# Altium schematic sheet Buck-Boost-5V.schdoc: TITRE
size Letter; ApprovedBy: APPROUVÉ PAR; Organization: Cegep Limoilou; Address1: 1300, 8e Avenue; Address2: Québec, QC; Address3: Canada; Address4: G1J 5L5; SheetNumber: 3; SheetTotal: 4
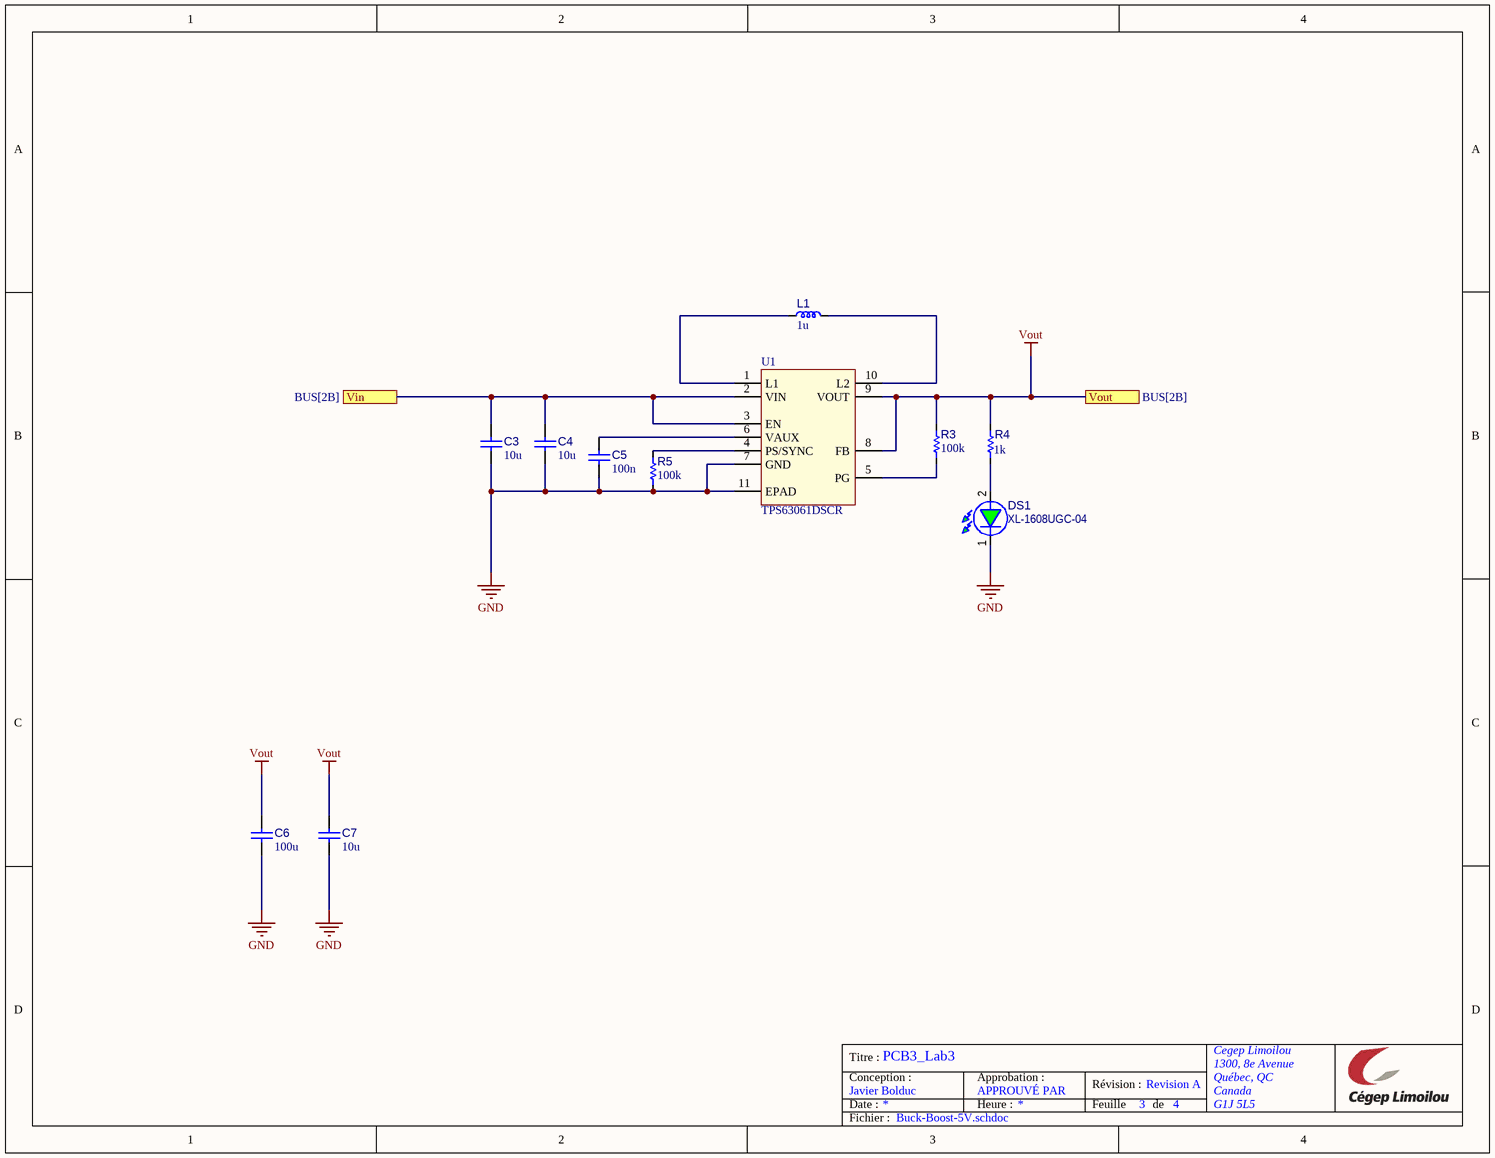
[diagram p0: Buck-Boost-5V.schdoc]

## Parts
C3  value 10u  [C_2012[0805]]  (hidden comment: CAP CER 10uF 10V X?? 0805)
C4  value 10u  [C_2012[0805]]  (hidden comment: CAP CER 10uF 10V X?? 0805)
C5  value 100n  [C_1608[0603]]  (hidden comment: CAP CER 100nF 50V 0603)
C6  value 100u  [C_3216[1206]]  (hidden comment: CAP CER 100uF 10V 1206)
C7  value 10u  [C_2012[0805]]  (hidden comment: CAP CER 10uF 10V X?? 0805)
DS1  XL-1608UGC-04  [D_LED_0603]
L1  value 1u  [L_3030[1212]]  (hidden comment: Inductor 1UH 1.6A 51mΩ SMD)
R3  value 100k  [R_1608[0603]]  (hidden comment: Res 100k 1% 0603)
R4  value 1k  [R_1608[0603]]  (hidden comment: Res 1k 1% 0603)
R5  value 100k  [R_1608[0603]]  (hidden comment: Res 100k 1% 0603)
U1  TPS63061DSCR  [U_WSON50P300X300X80-10N]

## Ports
Vin (see BUS[2B]), Vout (see BUS[2B])

## Nets
GND: C3.2 C4.2 C5.2 C6.2 C7.2 DS1.1(K) R5.2 U1.7(GND) U1.11(EPAD)
Vout: C6.1 C7.1 R3.1 R4.1 U1.8(FB) U1.9(VOUT) ; port Vout
Vin: C3.1 C4.1 U1.2(VIN) U1.3(EN) ; port Vin
NetC5_1: C5.1 U1.6(VAUX)
NetDS1_2: DS1.2(A) R4.2
NetL1_1: L1.1 U1.1(L1)
NetL1_2: L1.2 U1.10(L2)
NetR3_2: R3.2 U1.5(PG)
NetR5_1: R5.1 U1.4(PS/SYNC)

## Notes on the sheet
- Titre :
- Conception :
- Date :
- Javier Bolduc
- PCB3_Lab3
- Approbation :
- Heure :
- Révision :
- Feuille
- Revision A
- de
- Fichier :

## Library data of the parts
C3 C4 C7 = CAP026: Capacitor type 1; LibRef: CAP026; Code CEGEP: KCOND94SM; Localisation: R13-C015-3; Rated Voltage: 10V; Mounting Technology: SMT
C5 = CAP002: Capacitor type 1; Manufacturer 1: Yageo; Manufacturer Part Number 1: CC0603KRX7R9BB104; LibRef: CAP002; Code CEGEP: COND0143SM; Tolerance: 10%; Dielectric: X7R; Rated Voltage: 50V; Mounting Technology: SMT; Supplier 1: LCSC; Supplier Part Number 1: C14663
C6 = CAP005: Capacitor type 1; Manufacturer 1: Murata; Manufacturer Part Number 1: GRM31CR61A107MEA8L; LibRef: CAP005; Code CEGEP: KCOND04SM; Tolerance: 20%; Dielectric: X5R; Rated Voltage: 10V; Mounting Technology: SMT; Supplier 1: LCSC; Supplier Part Number 1: C883598
DS1 = D_LED_GREEN_0603: LED Green Clear 40mcd 140deg; Manufacturer 1: XINGLIGHT; Code CEGEP: KLEDVC0603; Value: Green; Manufacturer 2: Wurth; Manufacturer Part Number 1: XL-1608UGC-04; Manufacturer Part Number 2: 150060VS75000; Mounting Technology: SMT; Supplier 1: LCSC; Supplier 2: Digikey; Supplier Part Number 1: C965804; Supplier Part Number 2: 732-4980-1-ND
L1 = IND001: Inductor type 1; Manufacturer 1: Murata; Manufacturer Part Number 1: LQH3NPN1R0MMEL; LibRef: IND001; Code CEGEP: KPTSO09; Tolerance: 25%; Saturation Current: 2.35A; DCR: 0R025; Mounting Technology: SMT; Supplier 1: LCSC; Supplier Part Number 1: C703777
R3 R5 = RES002: Resistor type 1; Manufacturer 1: Yageo; Manufacturer Part Number 1: RC0603FR-07100KL; LibRef: RES002; Puissance: 1/10W; Max Working Voltage: 75V; Tolerance: 1%; Mounting Technology: SMT; Supplier 1: LCSC; Supplier Part Number 1: C14675
R4 = RES015: Resistor type 1; Manufacturer 1: Yageo; Manufacturer Part Number 1: RC0603FR-071KL; LibRef: RES015; Puissance: 1/10W; Max Working Voltage: 75V; Tolerance: 1%; Mounting Technology: SMT; Supplier 1: LCSC; Supplier Part Number 1: C22548
U1 = U_TPS63061DSC: IC REG BUCK BOOST 5V 2A 10WSON; Manufacturer 1: TI; Manufacturer Part Number 1: TPS63061DSCR; Mounting Technology: SMT; Supplier 1: LCSC; Supplier 2: Digikey; Supplier Part Number 1: C2876326; Supplier Part Number 2: 296-30205-1-ND